# Altium project aptomat.PrjPCB
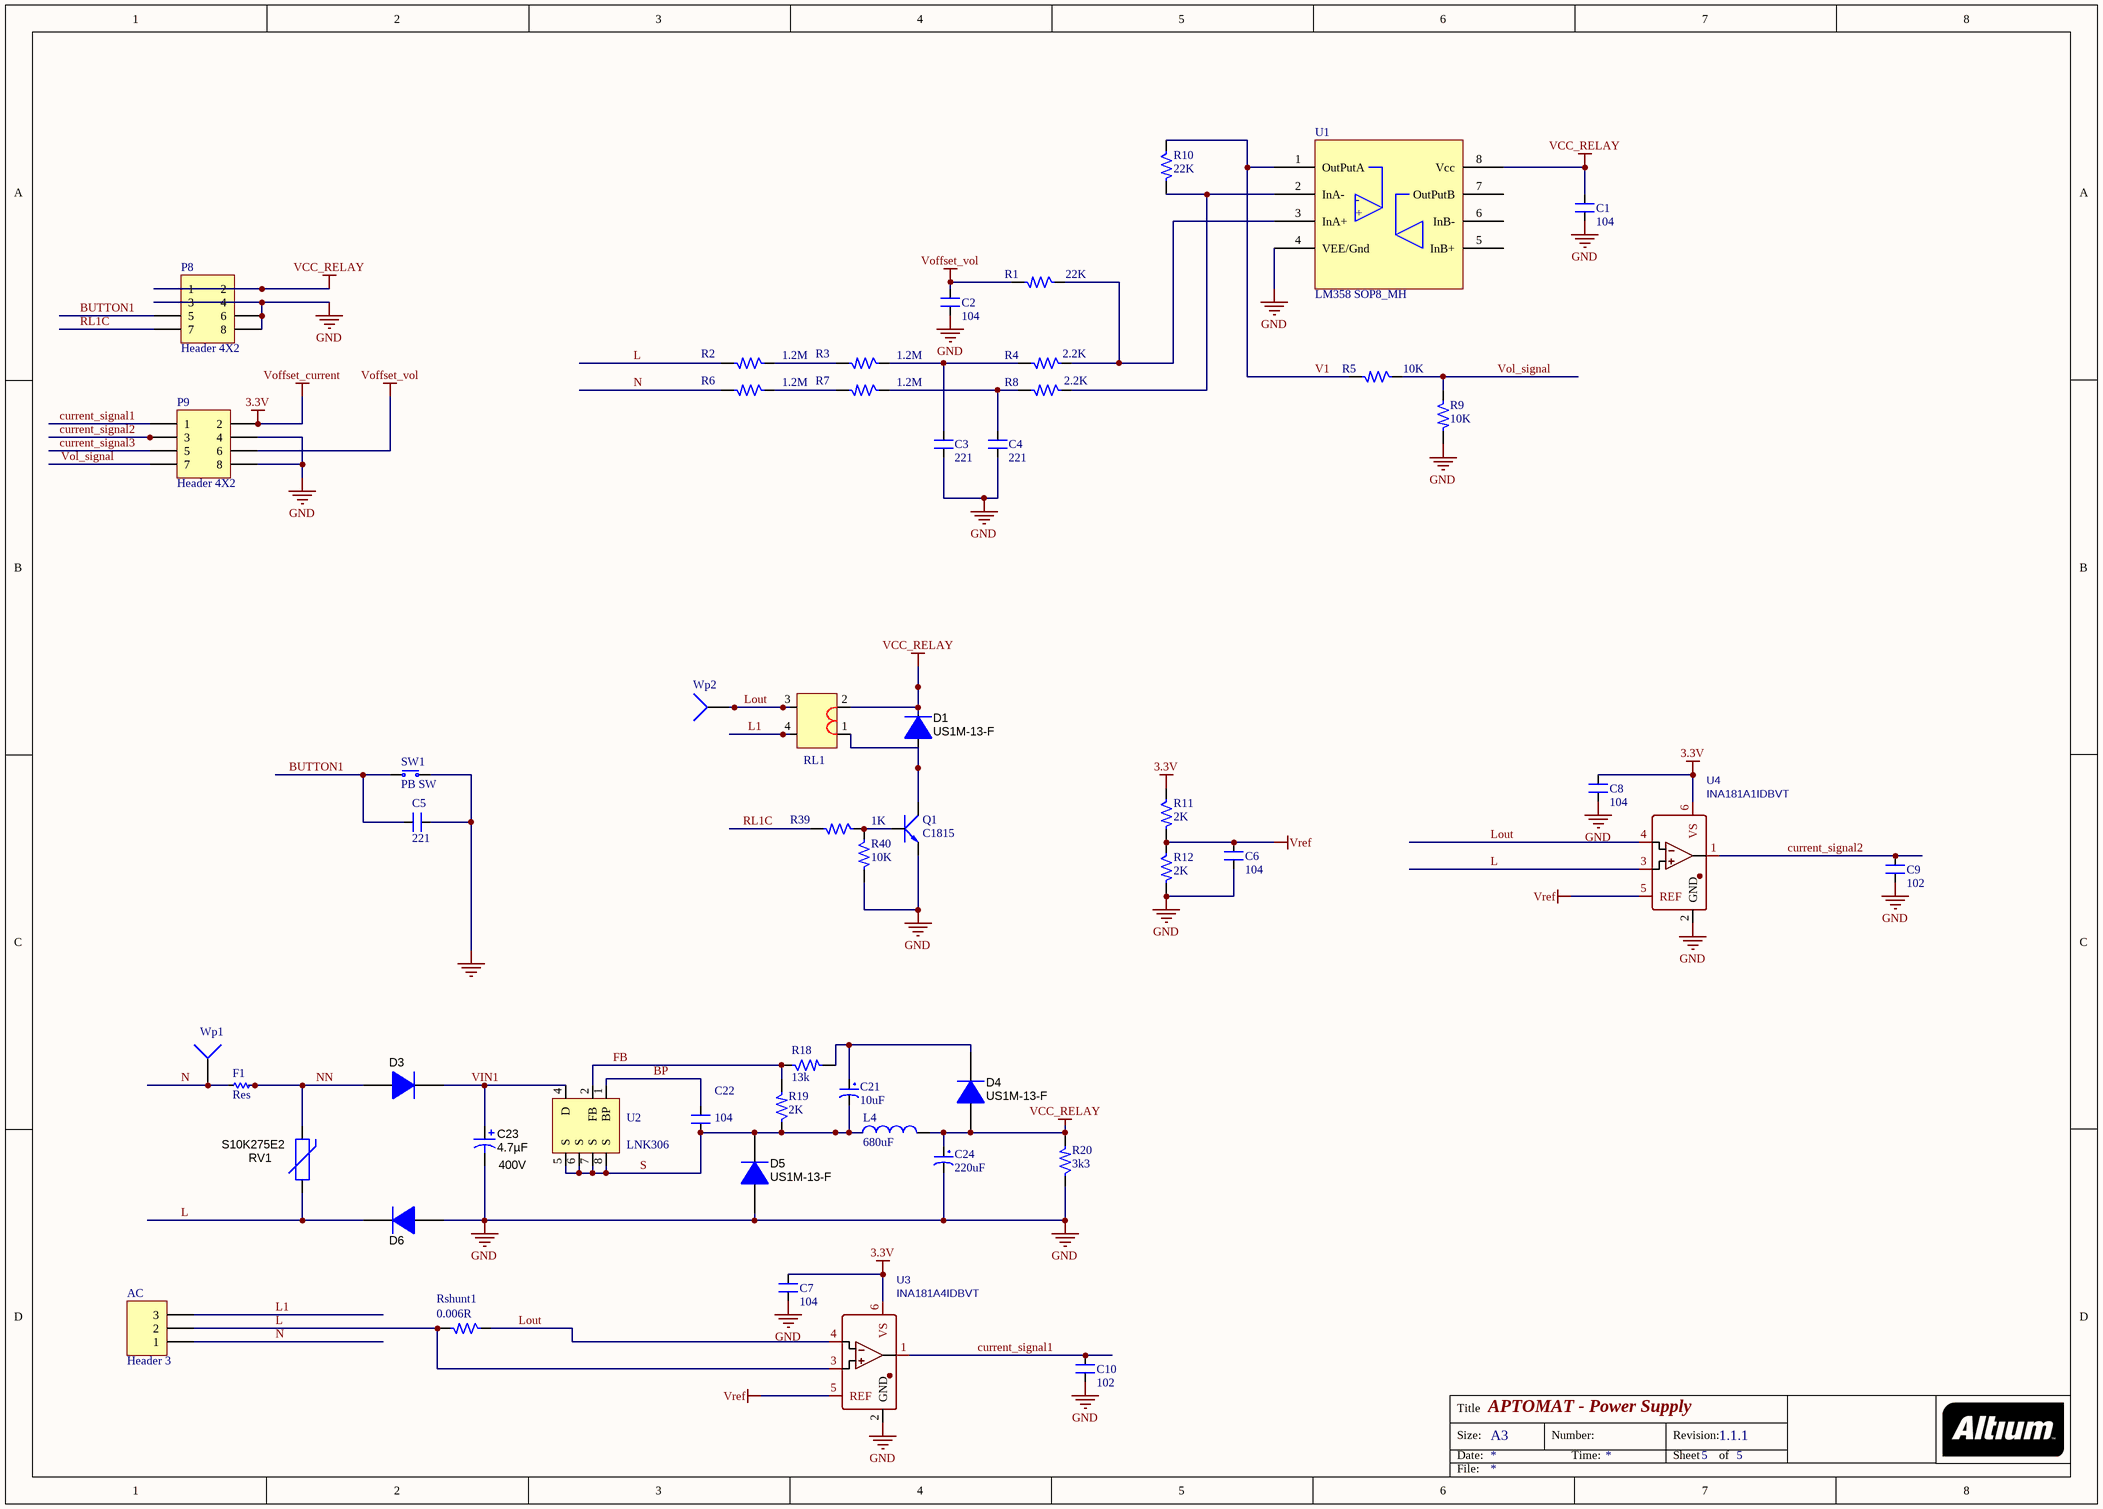
[diagram p0: Aptomat_power_supply.SchDoc]
1 sheet, 52 parts. Net scope: global (net labels, ports and power ports of the same name join across sheets).
Board files: Aptomat_Power.PcbDoc, PCB1.PcbDoc

## Sheet Aptomat_power_supply.SchDoc: APTOMAT - Power Supply
size A3; Revision: 1.1.1; SheetNumber: 5; SheetTotal: 5; DrawnBy: KJP; ProjectNumber: 4397; PCBRevision: 0071KJP; DocumentSize: A4; PCAName: PCA10040; PCBNumber: 400150; ProjectName: Quark

### Parts
AC  Header 3  [CHAN3DONG]
C1  104  [0805_HV]
C2  104  [0805_HV]
C3  221  [0805_HV]
C4  221  [0805_HV]
C5  221  [0805_HV]
C6  104  [0805_HV]
C7  104  [0805_HV]
C8  104  [0805_HV]
C9  102  [0805_HV]
C10  102  [0805_HV]
C21  10uF  [TU_NHOM_10uF_MH]
C22  104  [0805_HV]
C23  ValueDisplayed: 4.7µF  Value2: 400V  [PANACAP-G-GENERIC]  (hidden comment: 400AX6R8M8x11)
C24  220uF  [TU_NHOM_2.5_MH]
D1  US1M-13-F  [SMB]
D3  US1M-13-F  [SMB]  (value not drawn)
D4  US1M-13-F  [SMB]
D5  US1M-13-F  [SMB]
D6  US1M-13-F  [SMB]  (value not drawn)
F1  Res  [1206]
L4  680uF  [Inductor 4.5x5]
P8  Header 4X2  [HDR2X4]
P9  Header 4X2  [HDR2X4]
Q1  C1815  [SOT23B]
R1  22K  [0805_HV]
R2  1.2M  [1206]
R3  1.2M  [1206]
R4  2.2K  [0805_HV]
R5  10K  [0805_HV]
R6  1.2M  [1206]
R7  1.2M  [1206]
R8  2.2K  [0805_HV]
R9  10K  [0805_HV]
R10  22K  [0805_HV]
R11  2K  [0805_HV]
R12  2K  [0805_HV]
R18  13k  [0805_HV]
R19  2K  [0805_HV]
R20  3k3  [0805_HV]
R39  1K  [0805_HV]
R40  10K  [0805_HV]
RL1  Component_1  [RELAY30ASLA12VDC]  (value not drawn)
Rshunt1  0.006R  [RESC2728]
RV1  S10K275E2  [VAR_S10K275E2]
SW1  PB SW  [Switch-PB-6.2x6.3mm-SMD]
U1  LM358 SOP8_MH  [SOP 8]
U2  LNK306  [SOP 7]
U3  INA181A4IDBVT  [SOT95P280X145-6N]
U4  INA181A1IDBVT  [SOT95P280X145-6N]
Wp1  Socket  [PIN1]  (value not drawn)
Wp2  Socket  [PIN1]  (value not drawn)

### Nets
3.3V: C7.2 C8.2 P9.2 R11.1 U3.6(VS) U4.6(VS)  [also labelled Voffset_current]
GND: C1.1 C2.1 C3.1 C4.1 C5.1 C6.1 C7.1 C8.1 C9.1 C10.1 C23.2(-) C24.2 D5.2(A) D6.2(A) P8.3 P8.4 P8.6 P8.8 P9.4 P9.8 Q1.3(E) R9.2 R12.2 R20.1 R40.2 SW1.1(N.O) U1.4(VEE/Gnd) U3.2(GND) U4.2(GND)
VCC_RELAY: C1.2 C24.1 D1.1(K) D4.2(A) L4.2 P8.1 P8.2 R20.2 RL1.2 U1.8(Vcc)
Voffset_vol: C2.2 P9.6 R1.2
Vref: C6.2 R11.2 R12.1 U3.5(REF) U4.5(REF)
BP: C22.2 U2.1(BP)
BUTTON1: C5.2 P8.5 SW1.2(COM)
current_signal1: C10.2 P9.1 U3.1(OUT)
current_signal2: C9.2 P9.3 U4.1(OUT)
current_signal3: P9.5
FB: R18.1 R19.2 U2.2(FB)
L: AC.2 D6.1(K) R2.2 Rshunt1.2 RV1.1 U3.3(IN+) U4.3(IN+)
L1: AC.3 RL1.4
Lout: RL1.3 Rshunt1.1 U3.4(IN-) U4.4(IN-) Wp2.1
N: AC.1 F1.2 R6.2 Wp1.1
NN: D3.2(A) F1.1 RV1.2
RL1C: P8.7 R39.2
S: C21.2 C22.1 D5.1(K) L4.1 R19.1 U2.5(S) U2.6(S) U2.7(S) U2.8(S)
V1: R5.2 R10.1 U1.1(OutPutA)
VIN1: C23.1(+) D3.1(K) U2.4(D)
Vol_signal: P9.7 R5.1 R9.1
NetC3_2: C3.2 R3.1 R4.2
NetC4_2: C4.2 R7.1 R8.2
NetC21_1: C21.1 D4.1(K) R18.2
NetD1_2: D1.2(A) Q1.2(C) RL1.1
NetQ1_1: Q1.1(B) R39.1 R40.1
NetR1_1: R1.1 R4.1 U1.3(InA+)
NetR2_1: R2.1 R3.2
NetR6_1: R6.1 R7.2
NetR8_1: R8.1 R10.2 U1.2(InA-)

Not connected (* = marked no-connect by the designer): U1 5(InB+) 6(InB-) 7(OutPutB)

### Notes on the sheet
- Title
- Size:
- Date:
- A3
- Number:
- Time:
- Revision:
- Sheet
- of
- File:
- (in symbol LM358 SOP8_MH) -; +

### Library data of the parts
AC = Header 3: Header, 3-Pin; LatestRevisionDate: 17-Jul-2002; LatestRevisionNote: Re-released for DXP Platform.; Publisher: Altium Limited
C1-C10 C22 = CM: Cap SMD; Value: 103
C21 = TU_NHOM_10uF_25V_MH: Value: 47uF/16 - 50V; Description 1: 470uF/6,3V - 330uF/10V - 220uF/16V; Description 2: 100uF/25V - 35V - 47uF/50V - 22uF/100V; Description 3: 33uF => 47uF/63V - 1uF => 4,7uF/160V; Description 4: 1uF => 2,2uF/250V - 1uF/350V
C23 = 400AX6R8M8x11: CAP, AL, 6.8uF, 400V, +/-20%, TH; Manufacturer: Rubycon; Polarized: Y; CompType: Capacitor; U/M: EA; Cap_F: 0.0000068; Tolerance_%: 20; Value1: Unknown; VDC_V: 400; TaMin_C: -40; TaMax_C: 105; Cap_Case: 8x11; SymbolVersion: 2008-07-09; Value: 6.8uF; PartNumber: 400AX6R8M8x11; PackageReference: 8x11; RoHS: Y; MountType: TH; Technology: AL; Series: AX; Publisher: Texas Instruments; LatestRevisionDate: 2013-08-02; ComponentLink1Description: Datasheet link; ComponentLink1URL: http://www.rubycon.co.jp/de/catalog/e_pdfs/aluminum/e_ax.pdf
C24 = TU_NHOM_220uF_25V_MH: LINK: https://item.taobao.com/item.htm?spm=a230r.1.14.282.6c612953FsebRk&id=546158429968&ns=1&abbucket=10#detail
D1 D3-D6 = MURS160-13-F: Diode, Ultrafast, 600V, 1A, SMB; Manufacturer: Diodes Inc.; U/M: EA; Vf_V: 1.25; Value2: 1.25V; Io_A: 1; Vr_V: 600; TJmax_C: 150; RJC_CperW: 13; PartNumber: US1M-13-F; CompType: Diode; SymbolVersion: 2008-12-08; MountType: SMT; RoHS: Y; Value: 600V; PackageReference: SMB; Value1: 1A; Type: Ultrafast; Published: 2008-06-26; Publisher: Texas Instruments; LatestRevisionDate: 2013-06-21; ComponentLink1Description: Datasheet link; ComponentLink1URL: http://www.diodes.com/datasheets/ds30130.pdf; Supplier 1: Digi-Key; Supplier 2: Mouser; Supplier 3: Farnell
F1 = Res-SMD: Resistor; Manufacturer: Generic Components; Class: Passive; Published: 08/06/2000; Publisher: Altium Hobart Technology Centre
L4 = Inductor 4.5x5_MH
P8 P9 = Header 4X2: Header, 4-Pin, Dual row; LatestRevisionDate: 17-Jul-2002; LatestRevisionNote: Re-released for DXP Platform.; Publisher: Altium Limited
Q1 = C1815: NPN 600mW, ECB; Value: C1815
R1-R12 R18-R20 R39 R40 Rshunt1 = R: Resistor 1/4W; Value: R1/4W - 1K
RV1 = S10K275E2: Varistor 275V RMS 10MM Radial, TH; Manufacturer: EPCOS Inc; SymbolCreator: a0412235; SymbolVersion: 2012-06-04; PartNumber: S10K275E2; MountType: TH; ComponentLink1Description: Datasheet URL; ComponentLink1URL: http://www.epcos.com/inf/70/db/var_08/SIOV_Leaded_AdvanceD.pdf; RoHS: Y; PackageReference: 10mm Radial; Publisher: Texas Instruments; LatestRevisionDate: 2013-02-24; Supplier 1: Digi-Key; Supplier Part Number 1: 495-1433-ND
SW1 = Switch-PB-6.2x6.3mm-SMD: Tactile Switch, SPNO, SMD, 160gf, 6.2x6.3x2.5mm; Manufacturer: Dailywell; Manufacturer Part Number: TS604VM1-025BR-R; 2nd source part number: 688-SKHUALE010; Artikkelnr Noca: 50019106; Artikkelnr Simpro: N.A.; Part Number: Switch-PB-6.2x6.3mm-SMD; Datasheet: \\hizz\pro\app9717\Datasheet\switches\Daliywell\TS604VM1-025BR-R.pdf; Footprint Doc: Switch-PB-6.2x6.3mm-SMD; LatestRevisionDate: 2016-04-21; Pin Count: 4; Publisher: Nordic Semiconductor; Published: 2010-02-01; Value: PB SW; Note: *; Supplier: Cabcon; Supplier part number: TS604VM1-025BR-R; 2nd source Supplier: Mouser
U2 = Component_1
U3 U4 = INA181: BOM_Manufacturer: Texas Instruments; BOM_Manufacturer Part: INA181A2IDBVT; Contributor: LCSC; BOM_Supplier: LCSC; BOM_Supplier Part: C116200; spicePre: U
Wp1 Wp2 = Socket: LatestRevisionDate: 17-Jul-2002; LatestRevisionNote: Re-released for DXP Platform.; Publisher: Altium Limited